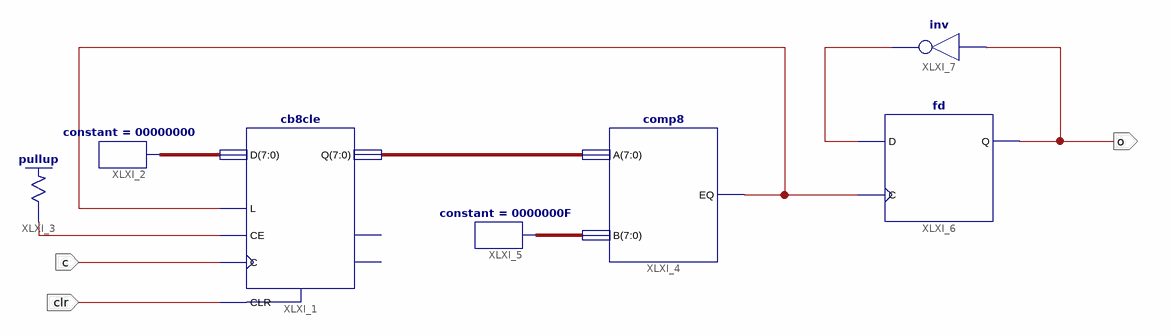
[diagram p0: schematic sheet 1]
// Xilinx ISE schematic delay_creator.sch (spartan6) as structural Verilog: 7 symbols, 3 ports
module delay_creator (
  input  c,
  input  clr,
  output o
);

  wire XLXN_3, XLXN_9, XLXN_13;
  wire [7:0] XLXN_1, XLXN_7, XLXN_8;

  cb8cle XLXI_1 (.C(c), .CE(XLXN_3), .CLR(clr), .D(XLXN_1), .L(XLXN_9), .Q(XLXN_7));  // open: CEO, TC
  constant #(.CValue("00000000")) XLXI_2 (.O(XLXN_1));
  \pullup  XLXI_3 (.O(XLXN_3));
  comp8 XLXI_4 (.A(XLXN_7), .B(XLXN_8), .EQ(XLXN_9));
  constant #(.CValue("0000000F")) XLXI_5 (.O(XLXN_8));
  fd XLXI_6 (.C(XLXN_9), .D(XLXN_13), .Q(o));
  not XLXI_7 (XLXN_13, o);
endmodule
